# EasyEDA schematic 8 Inputs Card with I2C schematic.json
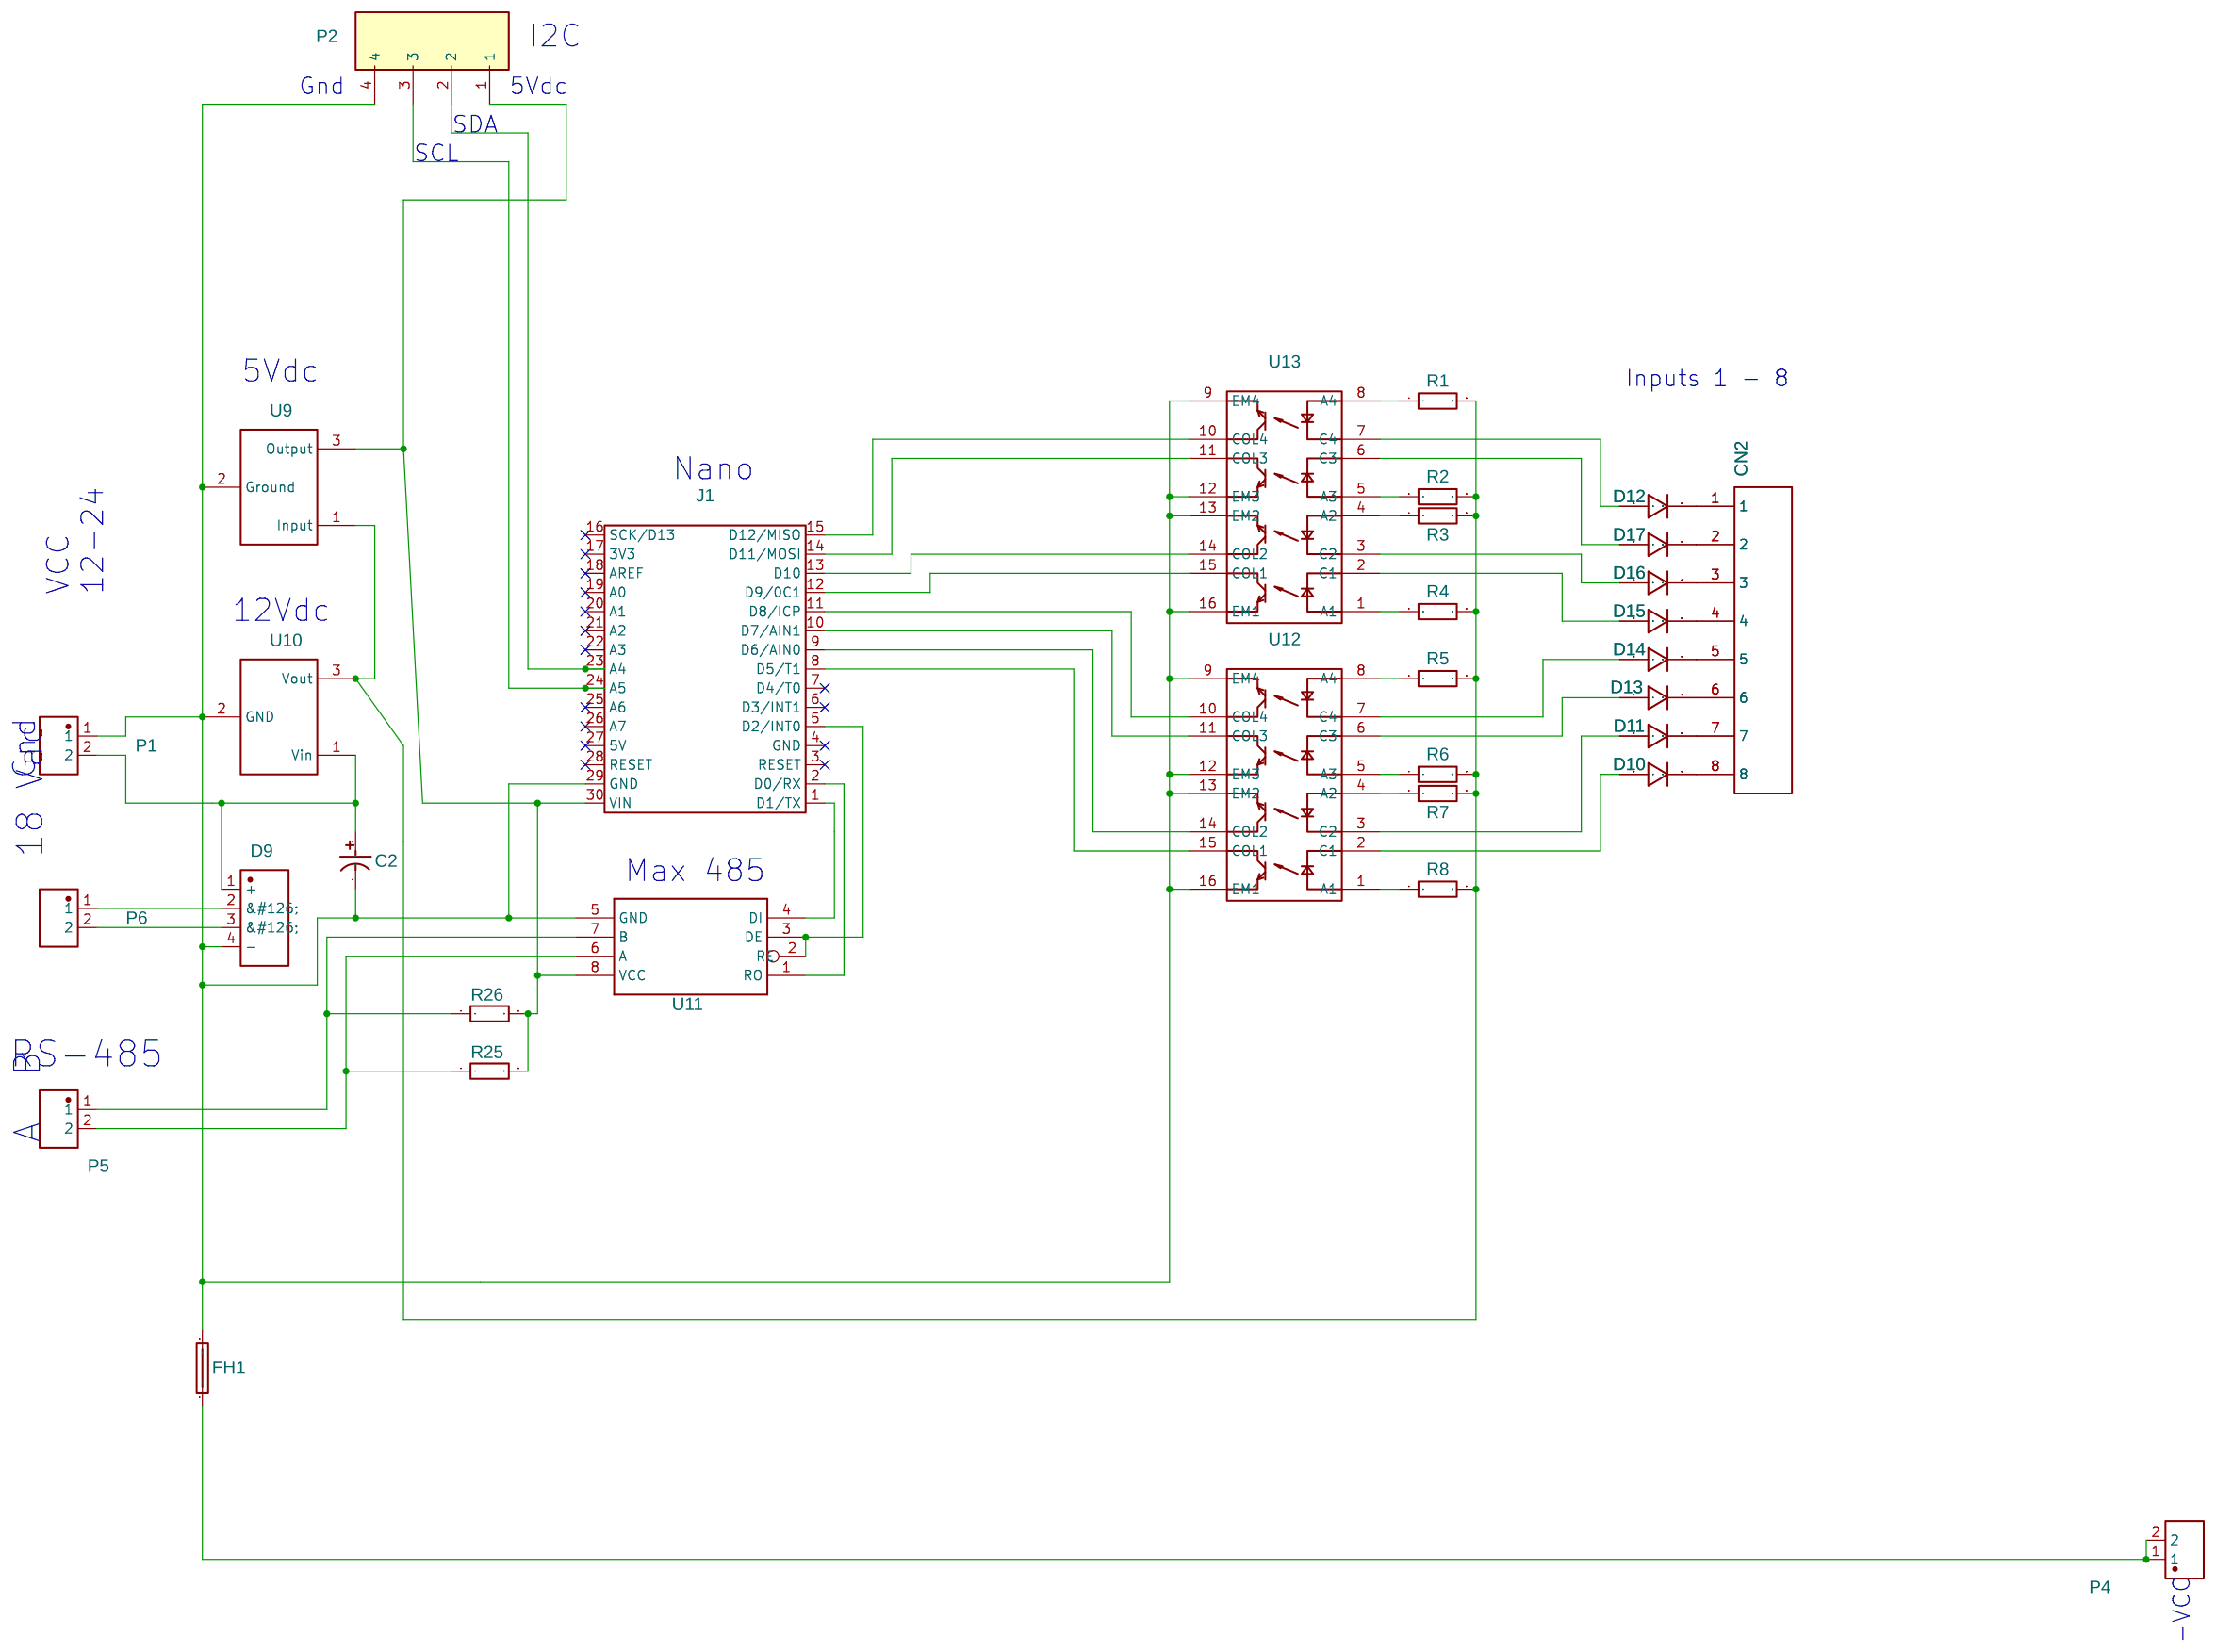
[diagram p0: schematic sheet]

## Parts
C2  470uF  [CAP-TH_BD16.0-P7.50-D1.2-FD]
CN2  WJ25C-B-7.62-8P-13-00A  [WJ25C-B-7.62-8P]
D9  D50SB100  [DIO-BG-TH_DXXSBXX]
D10  1N4001  [DO-41]
D11  1N4001  [DO-41]
D12  1N4001  [DO-41]
D13  1N4001  [DO-41]
D14  1N4001  [DO-41]
D15  1N4001  [DO-41]
D16  1N4001  [DO-41]
D17  1N4001  [DO-41]
FH1  64600001003  [FUSE-2P-25.8X9.0]
J1  Arduino_Nano_Header  [DIP-30_L43.18-W15.24-ARDUINONANO]
P1  WJ25C-B-2P  [CONN-TH_2P-P7.62_WJ25C-B-7.62-2P]
P2  WJ25C-B-4P  [WJ25C-B-7.62-4P]
P4  WJ25C-B-2P  [CONN-TH_2P-P7.62_WJ25C-B-7.62-2P]
P5  WJ25C-B-2P  [CONN-TH_2P-P7.62_WJ25C-B-7.62-2P]
P6  WJ25C-B-2P  [CONN-TH_2P-P7.62_WJ25C-B-7.62-2P]
R1  220  [RES-TH_BD2.2-L6.5-P10.50-D0.6]
R2  220  [RES-TH_BD2.2-L6.5-P10.50-D0.6]
R3  220  [RES-TH_BD2.2-L6.5-P10.50-D0.6]
R4  220  [RES-TH_BD2.2-L6.5-P10.50-D0.6]
R5  220  [RES-TH_BD2.2-L6.5-P10.50-D0.6]
R6  220  [RES-TH_BD2.2-L6.5-P10.50-D0.6]
R7  220  [RES-TH_BD2.2-L6.5-P10.50-D0.6]
R8  220  [RES-TH_BD2.2-L6.5-P10.50-D0.6]
R25  10K  [AXIAL-0.4]
R26  10K  [AXIAL-0.4]
U9  MC7805BTG  [TO-220-3_L10.0-W4.5-P2.54-L]
U10  CJ7812  [TO-220-3_L10.0-W4.5-P2.54-L]
U11  MAX485DIL  [DIP8]
U12  ILQ2  [DIP-16_L19.8-W6.5-P2.54-LS7.6-BL]
U13  ILQ2  [DIP-16_L19.8-W6.5-P2.54-LS7.6-BL]

## Library data of the parts
C2 = 470uF 100V 16*25: Supplier: LCSC; Manufacturer: ValuePro; Supplier Part: C72551
CN2 = -: Supplier: LCSC; Manufacturer: ReliaPro; image: //image.lceda.cn/szlcsc/C49492.jpg; Supplier Part: C49492
D9 = -: Supplier: LCSC; Supplier Part: C411148; Manufacturer: Leshan Radio; Contributor: LCSC
D10-D17 = -: Supplier Part: C169150; Supplier: LCSC; Manufacturer: DIOFIT; Contributor: LCSC
FH1 = -: Supplier: LCSC; Supplier Part: C206887; Manufacturer: Littelfuse; Contributor: LCSC
P1 P4-P6 = -: Supplier: LCSC; Manufacturer: ReliaPro; image: //image.lceda.cn/szlcsc/C8422.jpg; Supplier Part: C8422
P2 = WJ25C-B-4P: Supplier: LCSC; Manufacturer: ReliaPro; image: //image.lceda.cn/szlcsc/C8424.jpg; Supplier Part: C8424
R1-R8 = CFR0W4J0221A50: Supplier: LCSC; Manufacturer: UniOhm; Supplier Part: C61289
R25 R26 = CFR0W4J0103A50: Supplier: LCSC; Manufacturer: UniOhm; Supplier Part: C61299
U9 = -: Supplier: LCSC; Manufacturer: ON; image: //image.lceda.cn/szlcsc/C45385.jpg; Supplier Part: C45385
U10 = -: Supplier: LCSC; Manufacturer: CJ; image: //image.lceda.cn/szlcsc/C77894.jpg; Supplier Part: C77894
U11 = -: RS-485 transceiver; Contributor: SparkFun
U12 U13 = ILQ2: Supplier: LCSC; Manufacturer: VISHAY; Contributor: LCSC; Supplier Part: C145338

## Nets
Net-(C2-1): C2.1 D9.1(+) P1.2 U10.1(Vin)
Net-(C2-2): C2.2 D9.4(-) FH1.2 J1.29(GND) P1.1 P2.4 U9.2(Ground) U10.2(GND) U11.5(GND) U12.9(EM4) U12.12(EM3) U12.13(EM2) U12.16(EM1) U13.9(EM4) U13.12(EM3) U13.13(EM2) U13.16(EM1)
Net-(CN2-1): CN2.1 D12.2
Net-(CN2-2): CN2.2 D17.2
Net-(CN2-3): CN2.3 D16.2
Net-(CN2-4): CN2.4 D15.2
Net-(CN2-5): CN2.5 D14.2
Net-(CN2-6): CN2.6 D13.2
Net-(CN2-7): CN2.7 D11.2
Net-(CN2-8): CN2.8 D10.2
Net-(D9-2): D9.2(&#126;) P6.1
Net-(D9-3): D9.3(&#126;) P6.2
Net-(D10-1): D10.1 U12.2(C1)
Net-(D11-1): D11.1 U12.3(C2)
Net-(D12-1): D12.1 U13.7(C4)
Net-(D13-1): D13.1 U12.6(C3)
Net-(D14-1): D14.1 U12.7(C4)
Net-(D15-1): D15.1 U13.2(C1)
Net-(D16-1): D16.1 U13.3(C2)
Net-(D17-1): D17.1 U13.6(C3)
Net-(FH1-1): FH1.1 P4.1 P4.2
Net-(J1-1): J1.1(D1/TX) U11.4(DI)
Net-(J1-2): J1.2(D0/RX) U11.1(RO)
Net-(J1-5): J1.5(D2/INT0) U11.2(RE) U11.3(DE)
Net-(J1-8): J1.8(D5/T1) U12.15(COL1)
Net-(J1-9): J1.9(D6/AIN0) U12.14(COL2)
Net-(J1-10): J1.10(D7/AIN1) U12.11(COL3)
Net-(J1-11): J1.11(D8/ICP) U12.10(COL4)
Net-(J1-12): J1.12(D9/0C1) U13.15(COL1)
Net-(J1-13): J1.13(D10) U13.14(COL2)
Net-(J1-14): J1.14(D11/MOSI) U13.11(COL3)
Net-(J1-15): J1.15(D12/MISO) U13.10(COL4)
Net-(J1-23): J1.23(A4) P2.2
Net-(J1-24): J1.24(A5) P2.3
Net-(J1-30): J1.30(VIN) P2.1 R25.2 R26.2 U9.3(Output) U11.8(VCC)
Net-(P5-1): P5.1 R26.1 U11.7(B)
Net-(P5-2): P5.2 R25.1 U11.6(A)
Net-(R1-1): R1.1 U13.8(A4)
Net-(R1-2): R1.2 R2.2 R3.2 R4.2 R5.2 R6.2 R7.2 R8.2 U9.1(Input) U10.3(Vout)
Net-(R2-1): R2.1 U13.5(A3)
Net-(R3-1): R3.1 U13.4(A2)
Net-(R4-1): R4.1 U13.1(A1)
Net-(R5-1): R5.1 U12.8(A4)
Net-(R6-1): R6.1 U12.5(A3)
Net-(R7-1): R7.1 U12.4(A2)
Net-(R8-1): R8.1 U12.1(A1)

Not connected (* = marked no-connect by the designer): J1 3(RESET)* 4(GND)* 6(D3/INT1)* 7(D4/T0)* 16(SCK/D13)* 17(3V3)* 18(AREF)* 19(A0)* 20(A1)* 21(A2)* 22(A3)* 25(A6)* 26(A7)* 27(5V)* 28(RESET)*

## Notes on the sheet
- I2C
- Gnd
- 5Vdc
- SDA
- SCL
- 5Vdc
- Inputs 1 - 8
- Nano
- VCC
  12-24
- 12Vdc
- Gnd
- 18 Vac
- Max 485
- RS-485
- B
- A
- -VCC
